# EAGLE design PowerControlPCBv4 (EAGLE 9.6.2)
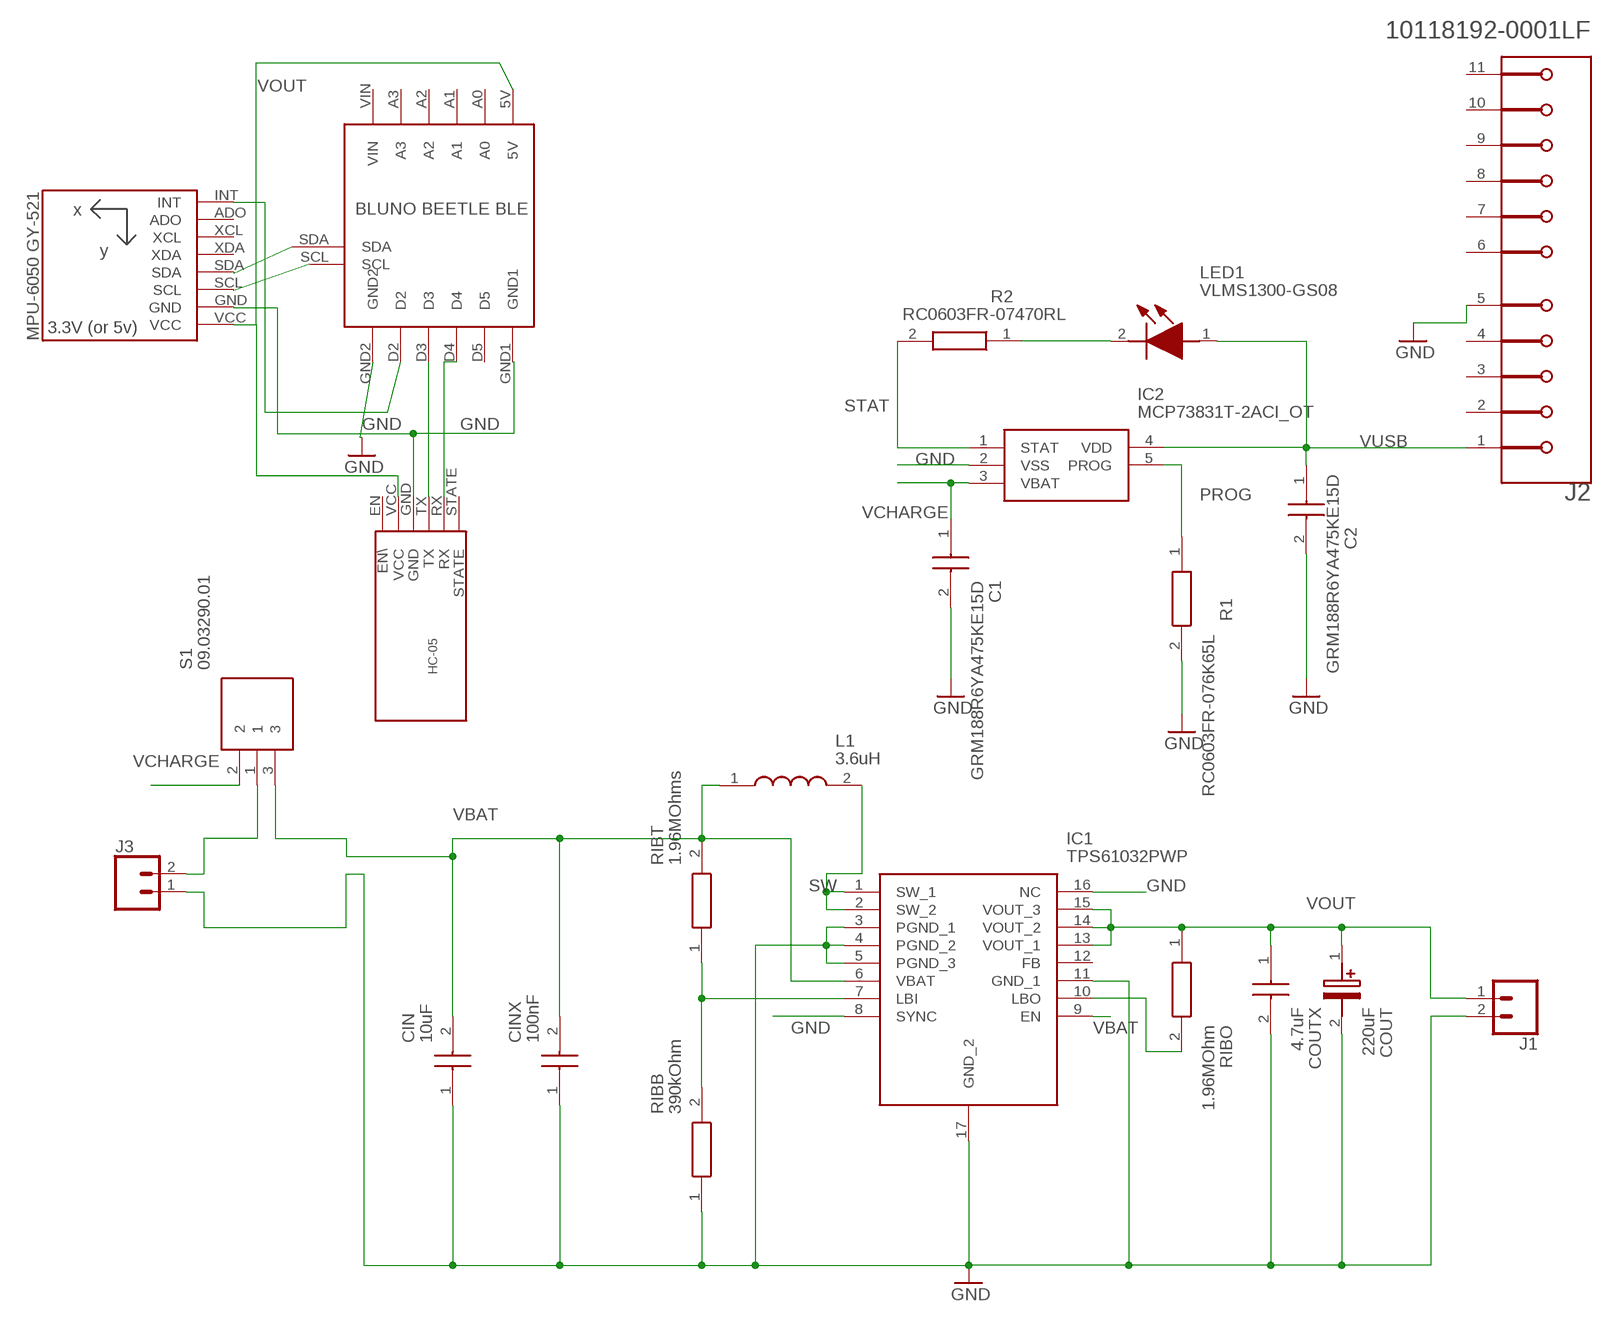
[diagram p0: schematic, sheet 1]

## Parts
C1  GRM188R6YA475KE15D  [CAPC1608X90N]
C2  GRM188R6YA475KE15D  [CAPC1608X90N]
CIN  10uF  GRJ155R60J106ME11D  [CAPC1005X70N]
CINX  100nF  GRM155R71A104KA01D  [CAPC1005X55N]
COUT  220uF  6TPE220MAZB  [POSCAP_B1_B1S_B1G_B15G_B2_B2S]
COUTX  4.7uF  GRM155R60J475ME87D  [CAPC1005X55N]
IC1  TPS61032PWP  [SOP65P640X120-17N]
IC2  MCP73831T-2ACI_OT  [SOT95P270X145-5N]
J1  CONN_02  [1X02]
J2  AMPHENOL_ICC_-_FCI_10118192-0001LFAMPHENOL_ICC_-_FCI_10118192-0001LF_0_0  [AMPHENOL_ICC_-_FCI_10118192-0001LF_0]
J3  CONN_02JST-PTH-2  [JST-2-PTH]
L1  3.6uH  7447798360  [WE-PDF59]
LED1  VLMS1300-GS08  [VLMS1300GS08]
R1  RC0603FR-076K65L  [RESC1608X55N]
R2  RC0603FR-07470RL  [RESC1608X55N]
RIBB  390kOhm  RC0603FR-07390KL  [RESC1608X55N]
RIBO  1.96MOhm  CRCW04021M96FKED  [RESC1005X40N]
RIBT  1.96MOhms  CRCW04021M96FKED  [RESC1005X40N]
S1  09.03290.01  [09.03290.01]
U1  GY-521MPU6050  [GY-521]
U$1  BLUNOBLE  [BLUNOBLE]
U$2  HC-05  [HC-05]

## Nets
GND: C1.2 C2.2 CIN.1 CINX.1 COUT.2(-) COUTX.2 IC1.3(PGND_1) IC1.4(PGND_2) IC1.5(PGND_3) IC1.8(SYNC) IC1.11(GND_1) IC1.16(NC) IC1.17(GND_2) IC2.2(VSS) J1.2 J2.5 J3.1 R1.2 RIBB.1 U1.GND U$1.GND1 U$1.GND2 U$2.GND
N$1: J3.2 S1.1
N$2: U$1.D4 U$2.RX
N$4: IC1.10(LBO) RIBO.2
N$5: IC1.7(LBI) RIBB.2 RIBT.1
N$6: U1.SDA U$1.SDA
N$9: U1.SCL U$1.SCL
N$10: U1.INT U$1.D2
N$12: LED1.2(K) R2.1
PROG: IC2.5(PROG) R1.1
STAT: IC2.1(STAT) R2.2
SW: IC1.1(SW_1) IC1.2(SW_2) L1.2
TXD3: U$1.D3 U$2.TX
VBAT: CIN.2 CINX.2 IC1.6(VBAT) IC1.9(EN) L1.1 RIBT.2 S1.3
VCHARGE: C1.1 IC2.3(VBAT) S1.2
VOUT: COUT.1(+) COUTX.1 IC1.13(VOUT_1) IC1.14(VOUT_2) IC1.15(VOUT_3) J1.1 RIBO.1 U1.VCC U$1.5V U$2.VCC
VUSB: C2.1 IC2.4(VDD) J2.1 LED1.1(A)
Unconnected: IC1.12(FB) J2.2 J2.3 J2.4 J2.6(MNT_1) J2.7(MNT_2) J2.8(MNT_3) J2.9(MNT_4) J2.10(MNT_5) J2.11(MNT_6) U1.ADO U1.XCL U1.XDA U$1.A0 U$1.A1 U$1.A2 U$1.A3 U$1.D5 U$2.EN(EN\) U$2.STATE

## Power pins joined to a net without a drawn wire
VIN: U$1.VIN

## Library data of the parts
C1 C2 = SamacSys_Parts:GRM188R6YA475KE15D: Multilayer Ceramic Capacitors MLCC - SMD/SMT 0603 4.7uF 35volts X5R 10% Source: Datasheet <https://psearch.en.murata.com/capacitor/product/GRM188R6YA475KE15#.html>; DESCRIPTION: Multilayer Ceramic Capacitors MLCC - SMD/SMT 0603 4.7uF 35volts X5R 10%; HEIGHT: 0.9mm; MANUFACTURER_NAME: Murata Electronics; MANUFACTURER_PART_NUMBER: GRM188R6YA475KE15D; MOUSER_PART_NUMBER: 81-GRM188R6YA475KE5D; MOUSER_PRICE-STOCK: https://www.mouser.co.uk/ProductDetail/Murata-Electronics/GRM188R6YA475KE15D?qs=eeBpzGFlv%252B%2FTEUAkSXFIlg%3D%3D
CIN = SamacSys_Parts:GRJ155R60J106ME11D: Multilayer Ceramic Capacitors MLCC - SMD/SMT 0402 10uF 6.3volts *Derate Voltage/Temp Source: Datasheet <https://altium.componentsearchengine.com/Datasheets/1/GRJ155R60J106ME11D.pdf>; DESCRIPTION: Multilayer Ceramic Capacitors MLCC - SMD/SMT 0402 10uF 6.3volts *Derate Voltage/Temp; HEIGHT: 0.7mm; MANUFACTURER_NAME: Murata Electronics; MANUFACTURER_PART_NUMBER: GRJ155R60J106ME11D; MOUSER_PART_NUMBER: 81-GRJ155R60J106ME1D; MOUSER_PRICE-STOCK: https://www.mouser.co.uk/ProductDetail/Murata-Electronics/GRJ155R60J106ME11D?qs=I53XXhTNm8s0qq2xY2TjBg%3D%3D
CINX = SamacSys_Parts:GRM155R71A104KA01D: Ceramic SMT capacitor 100nF 10Vdc Murata 0402 GRM 100nF Ceramic Multilayer Capacitor, 10 V dc X7R Dielectric ??10% Source: Datasheet <https://datasheet.datasheetarchive.com/originals/distributors/Datasheets_SAMA/ec4f1577dddcc7a13ddad897a28002d3.pdf>; DESCRIPTION: Ceramic SMT capacitor 100nF 10Vdc Murata 0402 GRM 100nF Ceramic Multilayer Capacitor, 10 V dc X7R Dielectric ??10%; HEIGHT: 0.55mm; MANUFACTURER_NAME: Murata Electronics; MANUFACTURER_PART_NUMBER: GRM155R71A104KA01D; MOUSER_PART_NUMBER: 81-GRM155R71A104KA1D; MOUSER_PRICE-STOCK: https://www.mouser.co.uk/ProductDetail/Murata-Electronics/GRM155R71A104KA01D?qs=8YPuuxuUzMIpJ%252BESZ%2Fj8CQ%3D%3D
COUT = SamacSys_Parts:6TPE220MAZB: Panasonic 220uF SMD Solid Polymer Tantalum Capacitor, 6.3 V dc +/-20%, POSCAP Series Source: Datasheet <http://industrial.panasonic.com/cdbs/www-data/pdf/AAA8000/AAA8000C36.pdf>; DESCRIPTION: Panasonic 220uF SMD Solid Polymer Tantalum Capacitor, 6.3 V dc +/-20%, POSCAP Series; HEIGHT: mm; MANUFACTURER_NAME: Panasonic; MANUFACTURER_PART_NUMBER: 6TPE220MAZB; MOUSER_PART_NUMBER: 667-6TPE220MAZB; MOUSER_PRICE-STOCK: https://www.mouser.co.uk/ProductDetail/Panasonic/6TPE220MAZB/?qs=OE1iw1LrrPEYdB6nQ0ttfA%3D%3D
COUTX = SamacSys_Parts:GRM155R60J475ME87D: Multilayer Ceramic Capacitors MLCC - SMD/SMT 0603 4.7uF 6.3volts *Derate Voltage/Temp Source: Datasheet <https://datasheet.datasheetarchive.com/originals/distributors/Datasheets_SAMA/ec4f1577dddcc7a13ddad897a28002d3.pdf>; DESCRIPTION: Multilayer Ceramic Capacitors MLCC - SMD/SMT 0603 4.7uF 6.3volts *Derate Voltage/Temp; HEIGHT: 0.55mm; MANUFACTURER_NAME: Murata Electronics; MANUFACTURER_PART_NUMBER: GRM155R60J475ME87D; MOUSER_PART_NUMBER: 81-GRM155R60J475ME8D; MOUSER_PRICE-STOCK: https://www.mouser.co.uk/ProductDetail/Murata-Electronics/GRM155R60J475ME87D?qs=pTGEtN%252BMLlBnU9jM8bPB0Q%3D%3D
IC1 = SamacSys_Parts:TPS61032PWP: 5-V Output, 1-A, 96% Efficient Boost Converter w/20uA Iq in TSSOP-16 Source: Datasheet <http://www.ti.com/lit/ds/symlink/tps61030.pdf>; DESCRIPTION: 5-V Output, 1-A, 96% Efficient Boost Converter w/20uA Iq in TSSOP-16; HEIGHT: 1.2mm; MANUFACTURER_NAME: Texas Instruments; MANUFACTURER_PART_NUMBER: TPS61032PWP; MOUSER_PART_NUMBER: 595-TPS61032PWP; MOUSER_PRICE-STOCK: https://www.mouser.co.uk/ProductDetail/Texas-Instruments/TPS61032PWP?qs=Gse6rAGbi7%252B07XodIBvuHQ%3D%3D
IC2 = SamacSys_Parts:MCP73831T-2ACI_OT: Li-Ion Charge Controller 4.2V SOT23-5 Source: Datasheet <http://ww1.microchip.com/downloads/en/DeviceDoc/20001984g.pdf>; DESCRIPTION: Li-Ion Charge Controller 4.2V SOT23-5; HEIGHT: 1.45mm; MANUFACTURER_NAME: Microchip; MANUFACTURER_PART_NUMBER: MCP73831T-2ACI/OT; MOUSER_PART_NUMBER: 579-MCP73831T-2ACIOT; MOUSER_PRICE-STOCK: https://www.mouser.co.uk/ProductDetail/Microchip-Technology-Atmel/MCP73831T-2ACI-OT?qs=yUQqVecv4qvbBQBGbHx0Mw%3D%3D
J1 = SparkFun-Connectors:CONN_02: Multi connection point. Often used as Generic Header-pin footprint for 0.1 inch spaced/style header connections On any of the 0.1 inch spaced packages, you can populate with these: Break Away Headers - Straight <https://www.sparkfun.com/products/116> (PRT-00116) Break Away Male Headers - Right Angle <https://www.sparkfun.com/products/553> (PRT-00553) Female Headers <https://www.sparkfun.com/products/115> (PRT-00115) Break Away Headers - Machine Pin <https://www.sparkfun.com/products/117> (PRT-00117) Break Away Female Headers - Swiss Machine Pin <https://www.sparkfun.com/products/743> (PRT-00743) For SCREWTERMINALS and SPRING TERMINALS visit here: Screw Terimnals on SparkFun.com <https://www.sparkfun.com/search/results?term=Screw+Terminals> (5mm/3.5mm/2.54mm spacing) This device is also useful as a general connection point to wire up your design to another part of your project. Our various solder wires solder well into these plated through hole pads. Hook-Up Wire - Assortment (Stranded, 22 AWG) <https://www.sparkfun.com/products/11375> (PRT-11375) Hook-Up Wire - Assortment (Solid Core, 22 AWG) <https://www.sparkfun.com/products/11367> (PRT-11367) View the entire wire category on our website here <https://www.sparkfun.com/categories/141> Special notes: Molex polarized connector foot print use with: PRT-08233 with associated crimp pins and housings. 2.54_SCREWTERM for use with PRT-10571. 3.5mm Screw Terminal footprints for PRT-08084 5mm Screw Terminal footprints for use with PRT-08432
J2 = FCI - 10118192-0001LF:AMPHENOL_ICC_-_FCI_10118192-0001LF: CONN RCPT USB2.0 MICRO B SMD R/A; AUTOMOTIVE: No; CENTROID_NOT_SPECIFIED: No; CONN_ORIENTATION: Right Angle; CONTACT_MATERIAL: Gold,Nickel; CURRENT_RATING: 1.8A; DATASHEET: https://cdn.amphenol-icc.com/media/wysiwyg/files/documentation/datasheet/inputoutput/io_usb_micro.pdf; DEVICE_CLASS_L1: Connectors; DEVICE_CLASS_L2: USB Connectors; DEVICE_CLASS_L3: unset; DIGIKEY_DESCRIPTION: CONN RCPT USB2.0 MICRO B SMD R/A; DIGIKEY_PART_NUMBER: 609-4613-1-ND; FOOTPRINT_URL: https://cdn.amphenol-icc.com/media/wysiwyg/files/drawing/10118192.pdf; FOOTPRINT_VARIANT_NAME_0: Recommended_Land_Pattern; HEIGHT: 3.08mm; IS_FEMALE: yes; LEAD_FREE: Yes; MF: Amphenol ICC / FCI; MFG_PACKAGE_IDENT: 0; MFG_PACKAGE_IDENT_DATE: 0; MFG_PACKAGE_IDENT_REV: 0; MOUSER_DESCRIPTION: Conn Micro USB Type B RCP 5 POS 0.65mm Solder RA SMD 5 Terminal 1 Port T/R; MOUSER_PART_NUMBER: 649-10118192-0001LF; MPN: 10118192-0001LF; NUMBER_OF_CONTACTS: 5; PACKAGE: CONN_USB; PITCH: 0.65mm; PREFIX: J; ROHS: Yes; SHIELDING: true; TEMPERATURE_RANGE_HIGH: +85°C; TEMPERATURE_RANGE_LOW: -55°C; USB_STANDARD: USB 2.0; VERIFICATION_VERSION: 0.0.0.3; VOLTAGE_RATING: 100V
J3 = SparkFun-Connectors:CONN_02: Multi connection point. Often used as Generic Header-pin footprint for 0.1 inch spaced/style header connections On any of the 0.1 inch spaced packages, you can populate with these: Break Away Headers - Straight <https://www.sparkfun.com/products/116> (PRT-00116) Break Away Male Headers - Right Angle <https://www.sparkfun.com/products/553> (PRT-00553) Female Headers <https://www.sparkfun.com/products/115> (PRT-00115) Break Away Headers - Machine Pin <https://www.sparkfun.com/products/117> (PRT-00117) Break Away Female Headers - Swiss Machine Pin <https://www.sparkfun.com/products/743> (PRT-00743) For SCREWTERMINALS and SPRING TERMINALS visit here: Screw Terimnals on SparkFun.com <https://www.sparkfun.com/search/results?term=Screw+Terminals> (5mm/3.5mm/2.54mm spacing) This device is also useful as a general connection point to wire up your design to another part of your project. Our various solder wires solder well into these plated through hole pads. Hook-Up Wire - Assortment (Stranded, 22 AWG) <https://www.sparkfun.com/products/11375> (PRT-11375) Hook-Up Wire - Assortment (Solid Core, 22 AWG) <https://www.sparkfun.com/products/11367> (PRT-11367) View the entire wire category on our website here <https://www.sparkfun.com/categories/141> Special notes: Molex polarized connector foot print use with: PRT-08233 with associated crimp pins and housings. 2.54_SCREWTERM for use with PRT-10571. 3.5mm Screw Terminal footprints for PRT-08084 5mm Screw Terminal footprints for use with PRT-08432; PROD_ID: CONN-09863; SKU: PRT-09914
L1 = SamacSys_Parts:7447798360: SMD-Power Inductor WE-PDF Source: Datasheet <https://componentsearchengine.com/Datasheets/1/7447798360.pdf>; DESCRIPTION: SMD-Power Inductor WE-PDF; HEIGHT: mm; MANUFACTURER_NAME: Wurth Elektronik; MANUFACTURER_PART_NUMBER: 7447798360; MOUSER_PART_NUMBER: 710-7447798360; MOUSER_PRICE-STOCK: https://www.mouser.com/Search/Refine.aspx?Keyword=710-7447798360
LED1 = SamacSys_Parts:VLMS1300-GS08: LED Uni-Color Super Red 639nm 2-Pin Chip 0603(1608Metric) T/R Source: Datasheet <https://datasheet.lcsc.com/szlcsc/Vishay-Intertech-VLMS1300-GS08_C83242.pdf>; DESCRIPTION: LED Uni-Color Super Red 639nm 2-Pin Chip 0603(1608Metric) T/R; HEIGHT: 1mm; MANUFACTURER_NAME: Vishay; MANUFACTURER_PART_NUMBER: VLMS1300-GS08; MOUSER_PART_NUMBER: 78-VLMS1300-GS08; MOUSER_PRICE-STOCK: https://www.mouser.co.uk/ProductDetail/Vishay-Semiconductors/VLMS1300-GS08?qs=uoVnq4yU%252B9LtZKILJuIDBQ%3D%3D
R1 = SamacSys_Parts:RC0603FR-076K65L: YAGEO (PHYCOMP) RC0603 F Source: Datasheet <https://datasheet.datasheetarchive.com/originals/distributors/Datasheets_SAMA/902f9e387b938f871d31120f5fc1d65e.pdf>; DESCRIPTION: YAGEO (PHYCOMP) RC0603 F; HEIGHT: 0.55mm; MANUFACTURER_NAME: KEMET; MANUFACTURER_PART_NUMBER: RC0603FR-076K65L
R2 = SamacSys_Parts:RC0603FR-07470RL: YAGEO - RC0603FR-07470RL - RES, THICK FILM, 470R, 1%, 0.1W, 0603, REEL Source: Datasheet <https://datasheet.datasheetarchive.com/originals/distributors/Datasheets_SAMA/902f9e387b938f871d31120f5fc1d65e.pdf>; DESCRIPTION: YAGEO - RC0603FR-07470RL - RES, THICK FILM, 470R, 1%, 0.1W, 0603, REEL; HEIGHT: 0.55mm; MANUFACTURER_NAME: KEMET; MANUFACTURER_PART_NUMBER: RC0603FR-07470RL; MOUSER_PART_NUMBER: 603-RC0603FR-07470RL; MOUSER_PRICE-STOCK: https://www.mouser.co.uk/ProductDetail/YAGEO/RC0603FR-07470RL?qs=gt6vzsuosg2Xv5elfMBXPA%3D%3D
RIBB = SamacSys_Parts:RC0603FR-07390KL: RESISTOR, 0603 390K Ohms +/-1% 1/10 W Source: Datasheet <https://datasheet.datasheetarchive.com/originals/distributors/Datasheets_SAMA/902f9e387b938f871d31120f5fc1d65e.pdf>; DESCRIPTION: RESISTOR, 0603 390K Ohms +/-1% 1/10 W; HEIGHT: 0.55mm; MANUFACTURER_NAME: YAGEO (PHYCOMP); MANUFACTURER_PART_NUMBER: RC0603FR-07390KL; MOUSER_PART_NUMBER: 603-RC0603FR-07390KL; MOUSER_PRICE-STOCK: https://www.mouser.co.uk/ProductDetail/Yageo/RC0603FR-07390KL?qs=0yPvnVz5%2FmqaU3B9dqGZZA%3D%3D
RIBO RIBT = SamacSys_Parts:CRCW04021M96FKED: VISHAY - CRCW04021M96FKED. - RES, THICK FILM, 1M96, 1%, 0.063W, 0402 Source: Datasheet <https://componentsearchengine.com/Datasheets/1/CRCW04021M96FKED.pdf>; DESCRIPTION: VISHAY - CRCW04021M96FKED. - RES, THICK FILM, 1M96, 1%, 0.063W, 0402; HEIGHT: 0.4mm; MANUFACTURER_NAME: Vishay; MANUFACTURER_PART_NUMBER: CRCW04021M96FKED; MOUSER_PART_NUMBER: 71-CRCW04021M96FKED; MOUSER_PRICE-STOCK: https://www.mouser.com/Search/Refine.aspx?Keyword=71-CRCW04021M96FKED
S1 = SamacSys_Parts:09.03290.01: SPCO straight standard lever SIL switch 2 Way Through Hole SIP Switch SPST Source: Datasheet <https://media.digikey.com/pdf/Data Sheets/EAO PDFs/series1k2_201004.pdf>; DESCRIPTION: SPCO straight standard lever SIL switch 2 Way Through Hole SIP Switch SPST; HEIGHT: mm; MANUFACTURER_NAME: EOZ; MANUFACTURER_PART_NUMBER: 09.03290.01
U1 = gy-521:GY-521
U$1 = my-library:BLUNOBLE
U$2 = Bluetooth:HC-05

## Board
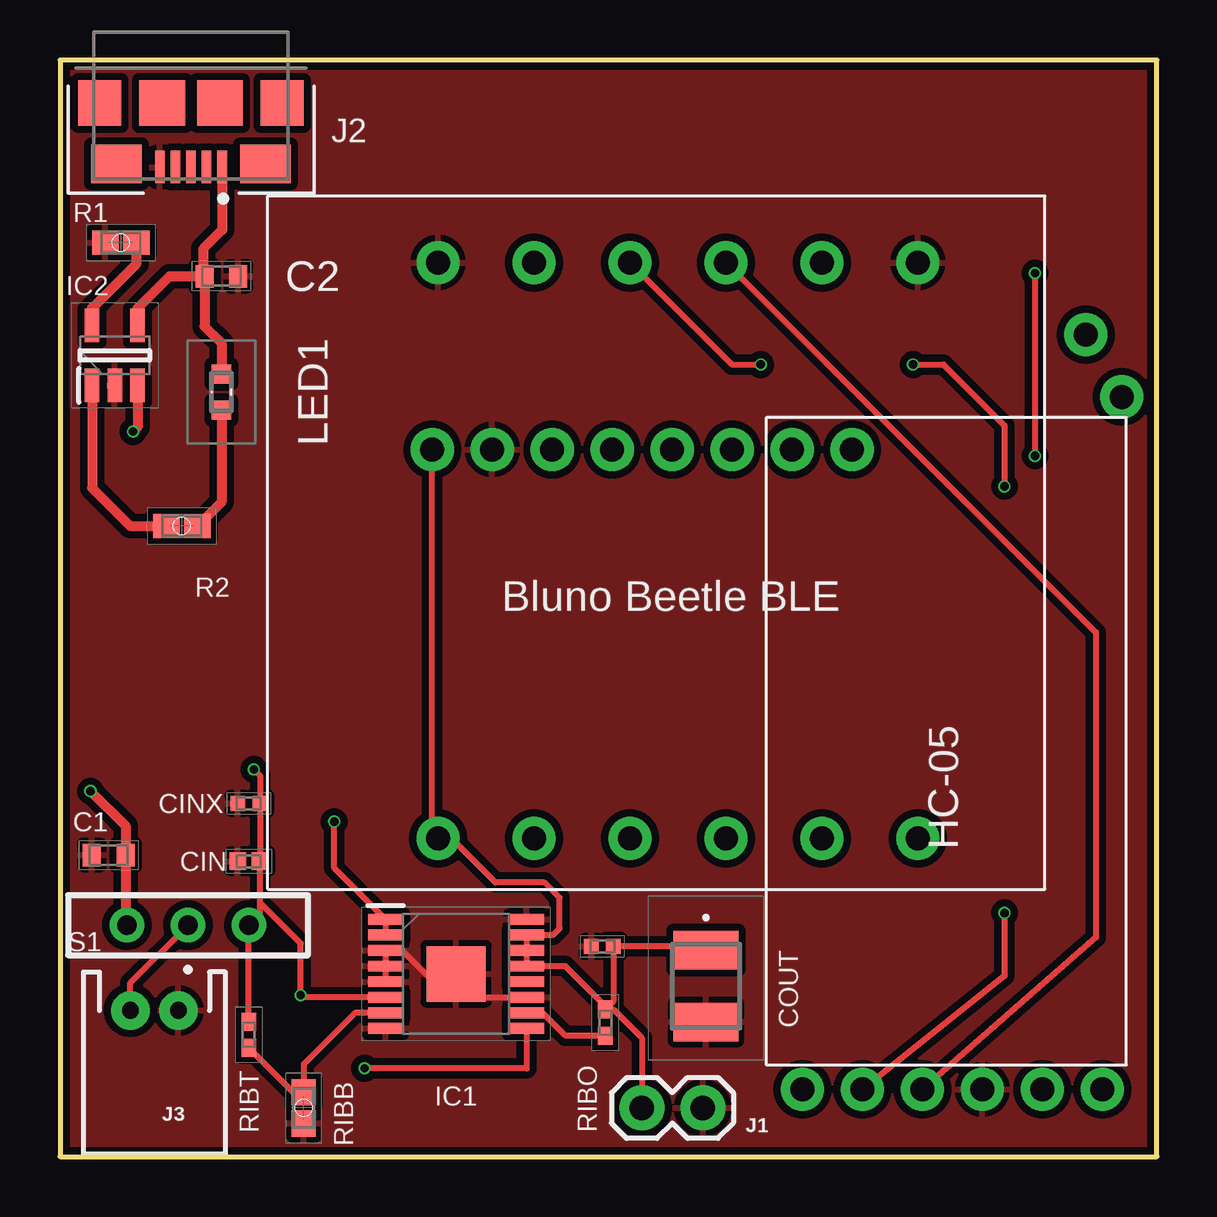
[diagram p1: board, top side]
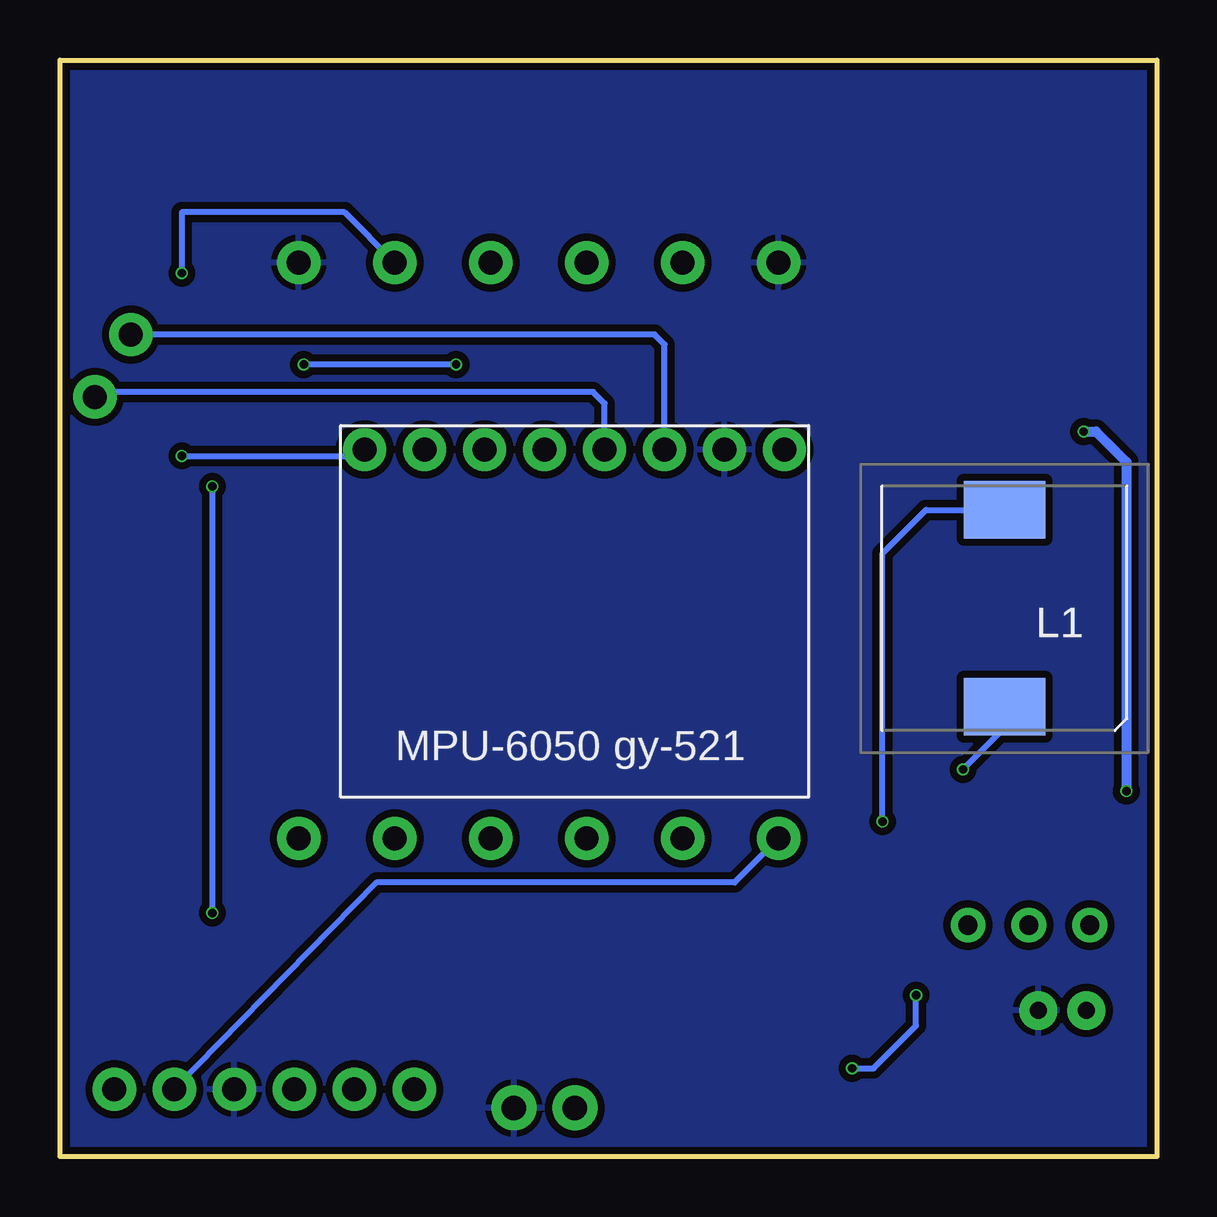
[diagram p2: board, bottom side, seen from below]

Size 45.72 x 45.72 mm. Coordinates in mm from the lower left corner, seen from the top.
Outline: 0,0 45.72,0.01 45.72,45.72 0,45.71 0,0
Copper layers (1*16): Top 0.035mm / dielectric 1.6mm / Bottom 0.035mm
Design rules "jlcpcb-2layers": minimum track width 5mil, minimum drill 0.3mm, track to track 5mil, track to pad 5mil, pad to pad 5mil, via to via 5mil, smd to smd 5mil, copper to edge 0.2mm, drill to drill 6mil, minimum pad ring 10mil, minimum via ring 3mil, stop-mask expansion 4mil, vias tented up to drill 0mil, thermal gap 10mil

### Footprints (pad centres in the part's own frame; a part is rotated, then mirrored left to right if it is on the bottom)
CAPC1608X90N = smd 0.75 x 0.94: 1 -0.7,0; 2 0.7,0
CAPC1005X70N = smd 0.69 x 0.72: 1 -0.46,0; 2 0.46,0
CAPC1005X55N = smd 0.6 x 0.62: 1 -0.46,0; 2 0.46,0
POSCAP_B1_B1S_B1G_B15G_B2_B2S = smd 1.6 x 2.7: 1 -1.5,0; 2 1.5,0
SOP65P640X120-17N = smd 1.475 x 0.45: 1 -2.938,2.275; 2 -2.938,1.625; 3 -2.938,0.975; 4 -2.938,0.325; 5 -2.938,-0.325; 6 -2.938,-0.975; 7 -2.938,-1.625; 8 -2.938,-2.275; 9 2.938,-2.275; 10 2.938,-1.625; 11 2.938,-0.975; 12 2.938,-0.325; 13 2.938,0.325; 14 2.938,0.975; 15 2.938,1.625; 16 2.938,2.275 | smd 2.46 x 2.31: 17 0,0
SOT95P270X145-5N = smd 1.4 x 0.6: 1 -1.25,0.95; 2 -1.25,0; 3 -1.25,-0.95; 4 1.25,-0.95; 5 1.25,0.95
1X02 = drill 1.016 pad 1.88: 1 0,0; 2 2.54,0
AMPHENOL_ICC_-_FCI_10118192-0001LF_0 = smd 0.4 x 1.35: 1 -1.3,2.56; 2 -0.65,2.56; 3 0,2.56; 4 0.65,2.56; 5 1.3,2.56 | smd 2.1 x 1.6: 6 -3.1,2.435; 7 3.1,2.435 | smd 1.8 x 1.9: 8 -3.8,-0.115; 11 3.8,-0.115 | smd 1.9 x 1.9: 9 -1.2,-0.115; 10 1.2,-0.115
JST-2-PTH = drill 0.7 pad 1.6: 1 -1,0; 2 1,0
WE-PDF59 = smd 3.4 x 2.4: 1 0,4.1; 2 0,-4.1
VLMS1300GS08 = smd 0.8 x 0.8: 1 -0.75,0; 2 0.75,0
RESC1608X55N = smd 1.1 x 1: 1 -0.65,0; 2 0.65,0
RESC1005X40N = smd 0.75 x 0.6: 1 -0.55,0; 2 0.55,0
09.03290.01 = drill 0.8 pad 1.3: 1 0,0; 2 -2.54,0; 3 2.54,0
GY-521 = drill 1 pad 1.676: ADO 1,2.5; GND 1,15; INT 1,0; SCL 1,12.5; SDA 1,10; VCC 1,17.5; XCL 1,5; XDA 1,7.5
BLUNOBLE = drill 1 pad 1.676: 5V 10.4,12; A0 6.4,12; A1 2.4,12; A2 -1.6,12; A3 -5.6,12; D2 -5.6,-12; D3 -1.6,-12; D4 2.4,-12; D5 6.4,-12; GND1 10.4,-12; GND2 -9.6,-12; SCL -16.6,-9; SDA -18.1,-6.4; VIN -9.6,12
HC-05 = drill 1 pad 1.676: EN -1,1; GND -1,6; RX -1,11; STATE -1,13.5; TX -1,8.5; VCC -1,3.5

### Placement (x,y rotation side)
C1  2.03,12.57 180 top
C2  6.73,36.7 0 top
CIN  7.87,12.32 0 top
CINX  7.87,14.73 0 top
COUT  26.92,7.11 270 top
COUTX  22.61,8.76 180 top
IC1  16.51,7.62 0 top
IC2  2.29,33.4 90 top
J1  24.26,2.03 0 top
J2  5.46,43.81 180 top
J3  3.94,6.1 180 top
L1  6.35,22.86 180 bottom
LED1  6.73,31.88 270 top
R1  2.54,38.1 180 top
R2  5.08,26.29 180 top
RIBB  10.16,2.03 90 top
RIBO  22.73,5.59 270 top
RIBT  7.87,5.08 90 top
S1  5.33,9.65 0 top
U1  33.02,30.48 270 bottom
U$1  26.16,25.27 180 top
U$2  44.45,3.81 90 top

### Tracks (layer width: path | path; a pad name or v marks a point on that pad's centre or on a via)
GND
  Top 0.254: IC1.5 IC1.4 IC1.3 14.27,8.6 16.21,6.64 IC1.11
  pour Top (isolate 0.305): 0,45.72 45.72,45.72 45.72,0 0,0
  pour Bottom (isolate 0.305): 0,45.72 0,0 45.72,0 45.72,45.72
N$1
  Top 0.254: J3.2 2.94,7.25 S1.1
N$2  (via drill 0.35)
  Top 0.254: U$1.D4 28.02,33.02 v29.21,33.02 | v35.56,33.02 36.83,33.02 39.37,30.48 v39.37,27.94 | v39.37,10.16 39.37,7.53 U$2.RX
  Bottom 0.254: v29.21,33.02 v35.56,33.02 | v39.37,27.94 v39.37,10.16
N$4
  Top 0.254: RIBO.2 21.08,5.04 20.12,6 IC1.10
N$5
  Top 0.254: IC1.7 12.3,6 10.16,3.85 RIBB.2 9.72,2.68 RIBT.1
N$6
  Bottom 0.254: U1.SDA 23.02,31.4 23.5,31.88 44.06,31.88 U$1.SDA
N$9
  Bottom 0.254: U1.SCL 20.52,33.85 20.94,34.27 U$1.SCL
N$10  (via drill 0.35)
  Top 0.254: v40.64,36.83 v40.64,29.21
  Bottom 0.254: U$1.D2 33.86,39.37 40.64,39.37 v40.64,36.83 | v40.64,29.21 33.29,29.21 U1.INT
N$12
  Top 0.406: LED1.2 6.73,27.29 R2.1
PROG
  Top 0.406: R1.1 3.19,37.23 1.34,35.37 IC2.5
STAT
  Top 0.406: IC2.1 1.34,27.87 2.92,26.29 R2.2
SW  (via drill 0.35)
  Top 0.254: IC1.2 IC1.1 11.43,12.04 v11.43,13.97
  Bottom 0.254: L1.2 6.48,26.96 7.84,26.96 9.62,26.96 11.43,25.15 v11.43,13.97
TXD3
  Top 0.254: U$1.D3 43.18,21.86 43.18,9.14 U$2.TX
VBAT  (via drill 0.35)
  Top 0.254: v8.08,16.14 8.33,15.89 CINX.2 CIN.2 8.33,10.59 | IC1.9 19.45,3.68 v12.7,3.68 | IC1.6 10.12,6.64 v10.03,6.73 10.03,8.89 8.33,10.59 | 8.33,10.59 8.33,10.11 S1.3 RIBT.2
  Bottom 0.254: L1.1 6.35,17.87 v8.08,16.14 | v12.7,3.68 11.81,3.68 10.03,5.46 v10.03,6.73
VCHARGE  (via drill 0.35)
  Top 0.406: v1.27,15.24 2.73,13.78 C1.1 2.73,9.71 S1.2 | v3.05,30.23 3.24,30.41 IC2.3
  Bottom 0.406: v1.27,15.24 1.27,28.96 2.54,30.23 v3.05,30.23
VOUT
  Top 0.254: COUT.1 26.77,8.76 COUTX.1 23.07,6.47 RIBO.1 22.86,6.14 | J1.1 24.26,4.95 23.07,6.14 22.86,6.14 | U1.VCC 15.52,13.52 U$1.5V 16.32,13.27 18.16,11.43 20.19,11.43 20.83,10.79 20.83,9.53 20.55,9.24 IC1.15 IC1.14 IC1.13 21.05,7.95 22.86,6.14
  Bottom 0.254: U$1.5V 17.61,11.43 32.53,11.43 U$2.VCC
VUSB
  Top 0.254: 5.97,36.77 C2.1
  Top 0.406: J2.1 6.76,38.64 5.97,37.85 5.97,36.77 | LED1.1 6.73,33.91 6.03,34.61 C2.1 4.57,36.7 3.24,35.37 IC2.4